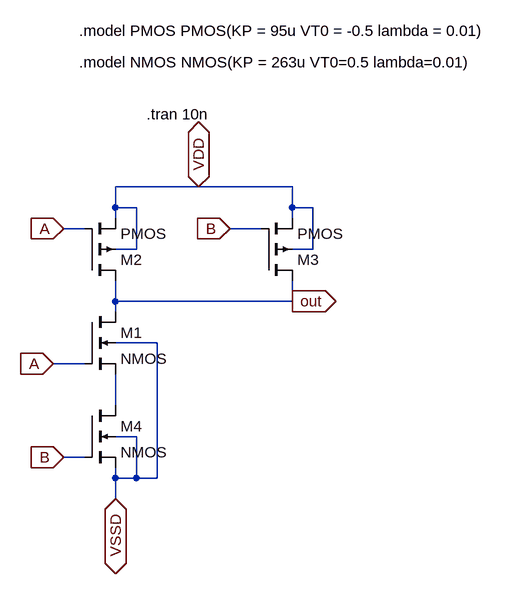
[diagram p0: schematic my_nand_1GHz.asc]
my_nand_1GHz.asc, the LTspice schematic file:
Version 4
SHEET 1 1072 680
WIRE 576 -16 448 -16
WIRE 720 -16 576 -16
WIRE 448 16 448 -16
WIRE 480 16 448 16
WIRE 720 16 720 -16
WIRE 752 16 720 16
WIRE 448 32 448 16
WIRE 720 32 720 16
WIRE 400 48 368 48
WIRE 672 48 624 48
WIRE 480 80 480 16
WIRE 480 80 448 80
WIRE 752 80 752 16
WIRE 752 80 720 80
WIRE 448 160 448 128
WIRE 720 160 720 128
WIRE 720 160 448 160
WIRE 448 176 448 160
WIRE 512 224 448 224
WIRE 400 256 352 256
WIRE 448 320 448 272
WIRE 480 368 448 368
WIRE 400 400 368 400
WIRE 448 432 448 416
WIRE 480 432 480 368
WIRE 480 432 448 432
WIRE 512 432 512 224
WIRE 512 432 480 432
WIRE 448 464 448 432
FLAG 368 48 A
IOPIN 368 48 In
FLAG 352 256 A
IOPIN 352 256 In
FLAG 624 48 B
IOPIN 624 48 In
FLAG 368 400 B
IOPIN 368 400 In
FLAG 576 -16 VDD
IOPIN 576 -16 BiDir
FLAG 448 464 VSSD
IOPIN 448 464 BiDir
FLAG 720 160 out
IOPIN 720 160 Out
SYMBOL nmos4 400 176 R0
SYMATTR InstName M1
SYMATTR Value2 l=180n w=3.5u
SYMBOL pmos4 400 128 M180
SYMATTR InstName M2
SYMATTR Value2 l=180n w=4.5u
SYMBOL pmos4 672 128 M180
SYMATTR InstName M3
SYMATTR Value2 l=180n w=4.5u
SYMBOL nmos4 400 320 R0
SYMATTR InstName M4
SYMATTR Value2 l=180n w=3.5u
TEXT 496 -128 Left 2 !.tran 10n
TEXT 392 -256 Left 2 !.model PMOS PMOS(KP = 95u VT0 = -0.5 lambda = 0.01)
TEXT 392 -208 Left 2 !.model NMOS NMOS(KP = 263u VT0=0.5 lambda=0.01)

The netlist it stands for:
* my_nand_1GHz.asc
M1 out A N001 VSSD NMOS l=180n w=3.5u
M2 out A VDD VDD PMOS l=180n w=4.5u
M3 out B VDD VDD PMOS l=180n w=4.5u
M4 N001 B VSSD VSSD NMOS l=180n w=3.5u
.model NMOS NMOS
.model PMOS PMOS
.lib standard.mos
.tran 10n
.model PMOS PMOS(KP = 95u VT0 = -0.5 lambda = 0.01)
.model NMOS NMOS(KP = 263u VT0=0.5 lambda=0.01)
.backanno
.end